# EAGLE schematic RoverBaseboard (EAGLE 6.4)
DATABASE: /home/mes/eagle/PARTSDB.txt
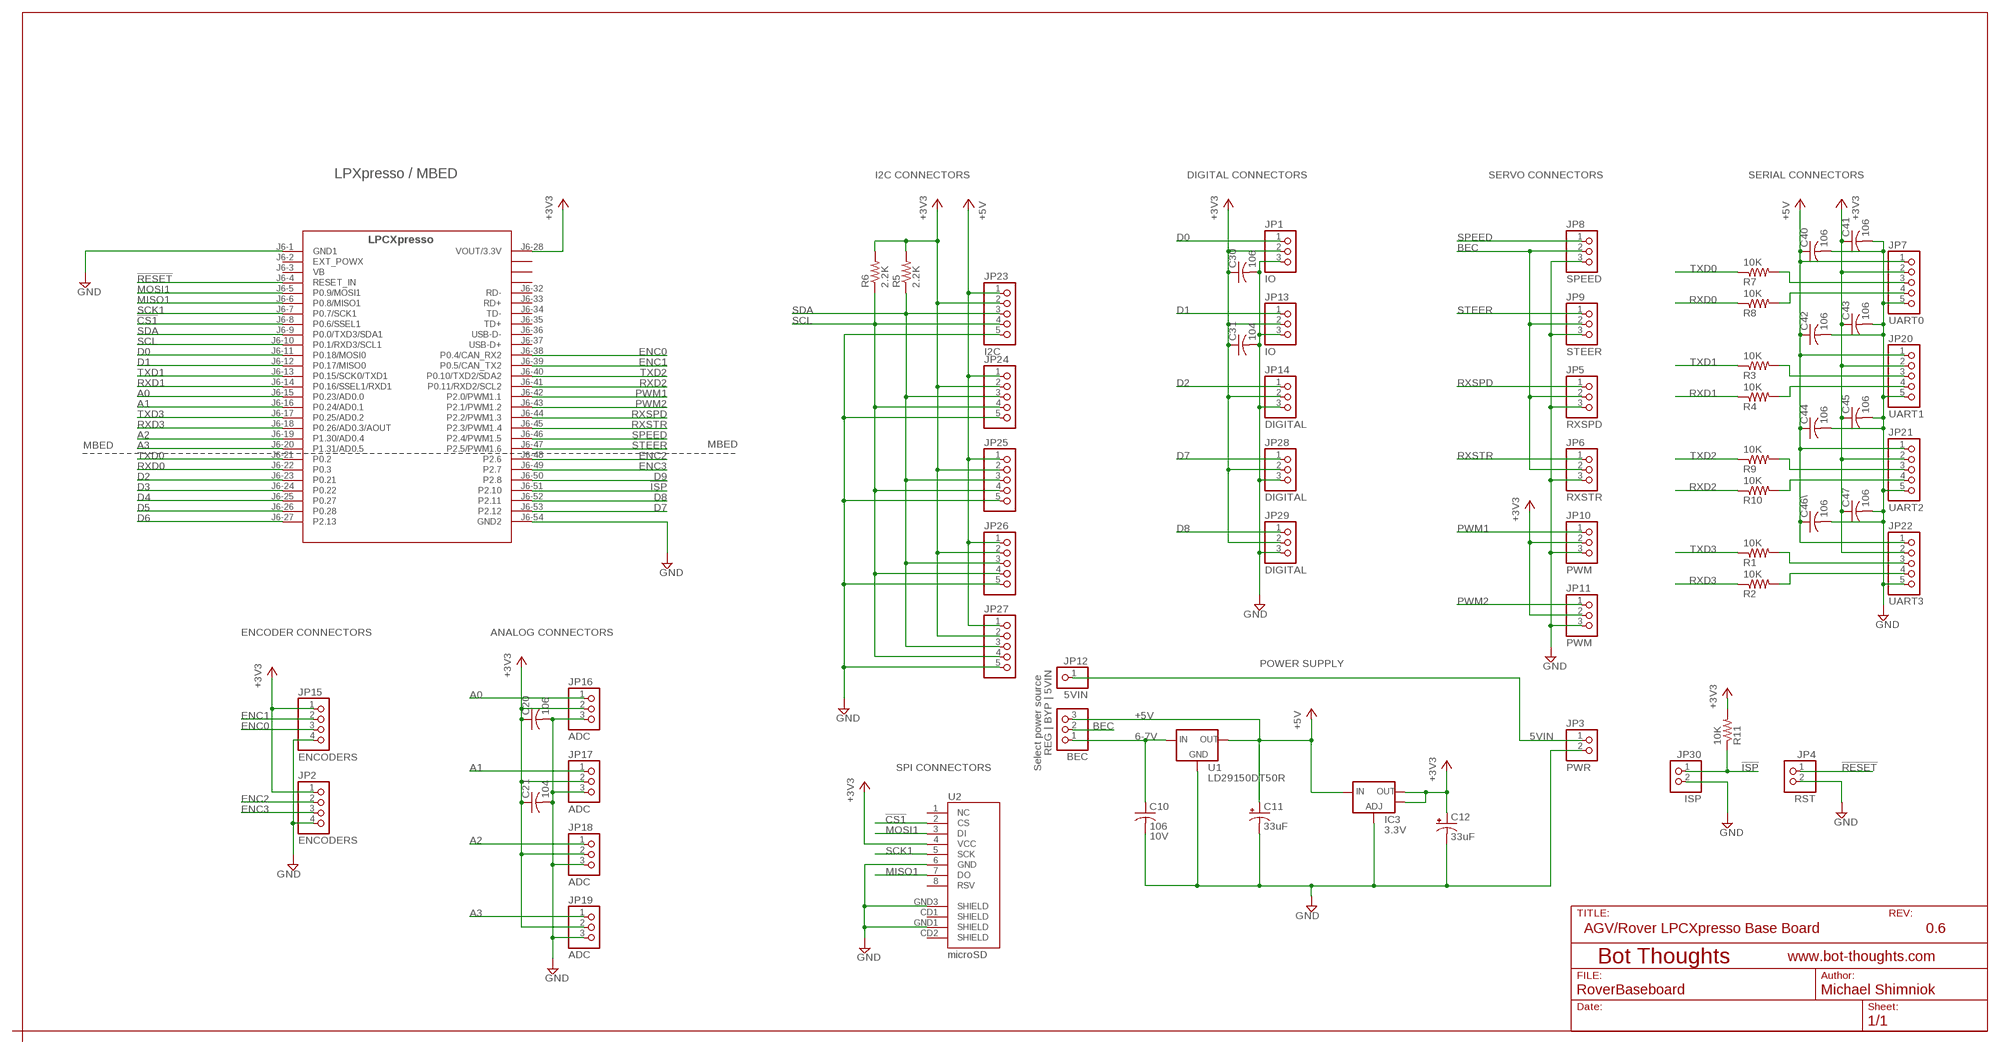
[diagram p0: schematic, sheet 1]

## Parts
BEC  REG | BYP | 5VIN  PINHD-1X03_2.54-S  [1X03-S]
C10  106  C-USC1206  [C1206]
C11  33uF  CPOL-USSMCB  [SMC_B]
C12  33uF  CPOL-USSMCB  [SMC_B]
C20  106  C-USC0603  [C0603]
C21  104  C-USC0603  [C0603]
C30  106  C-USC0603  [C0603]
C31  104  C-USC0603  [C0603]
C40  106  C-USC0603  [C0603]
C41  106  C-USC0603  [C0603]
C42  106  C-USC0603  [C0603]
C43  106  C-USC0603  [C0603]
C44  106  C-USC0603  [C0603]
C45  106  C-USC0603  [C0603]
C46\  106  C-USC0603  [C0603]
C47  106  C-USC0603  [C0603]
IC3  3.3V  V_REG_LM1117SOT223  [SOT223]
JP1  IO  PINHD-1X03_2.54-S  [1X03-S]
JP2  ENCODERS  PINHD-1X04_2.54-S  [1X04-S]
JP3  PWR  PINHD-1X02_2.54-S  [1X02-S]
JP4  RST  PINHD-1X02_2.54-S  [1X02-S]
JP5  RXSPD  PINHD-1X03_2.54-S  [1X03-S]
JP6  RXSTR  PINHD-1X03_2.54-S  [1X03-S]
JP7  UART0  PINHD-1X05_2.54-S  [1X05-S]
JP8  SPEED  PINHD-1X03_2.54-S  [1X03-S]
JP9  STEER  PINHD-1X03_2.54-S  [1X03-S]
JP10  PWM  PINHD-1X03_2.54-S  [1X03-S]
JP11  PWM  PINHD-1X03_2.54-S  [1X03-S]
JP12  5VIN  PINHD-1X01_2.54-S  [1X01-S]
JP13  IO  PINHD-1X03_2.54-S  [1X03-S]
JP14  DIGITAL  PINHD-1X03_2.54-S  [1X03-S]
JP15  ENCODERS  PINHD-1X04_2.54-S  [1X04-S]
JP16  ADC  PINHD-1X03_2.54-S  [1X03-S]
JP17  ADC  PINHD-1X03_2.54-S  [1X03-S]
JP18  ADC  PINHD-1X03_2.54-S  [1X03-S]
JP19  ADC  PINHD-1X03_2.54-S  [1X03-S]
JP20  UART1  PINHD-1X05_2.54-S  [1X05-S]
JP21  UART2  PINHD-1X05_2.54-S  [1X05-S]
JP22  UART3  PINHD-1X05_2.54-S  [1X05-S]
JP23  I2C  PINHD-1X05_2.54-S  [1X05-S]
JP24  PINHD-1X05_2.54-S  [1X05-S]
JP25  PINHD-1X05_2.54-S  [1X05-S]
JP26  PINHD-1X05_2.54-S  [1X05-S]
JP27  PINHD-1X05_2.54-S  [1X05-S]
JP28  DIGITAL  PINHD-1X03_2.54-S  [1X03-S]
JP29  DIGITAL  PINHD-1X03_2.54-S  [1X03-S]
JP30  ISP  PINHD-1X02_2.54-S  [1X02-S]
R1  10K  R-US_R0603  [R0603]
R2  10K  R-US_R0603  [R0603]
R3  10K  R-US_R0603  [R0603]
R4  10K  R-US_R0603  [R0603]
R5  2.2K  R-US_R0603  [R0603]
R6  2.2K  R-US_R0603  [R0603]
R7  10K  R-US_R0603  [R0603]
R8  10K  R-US_R0603  [R0603]
R9  10K  R-US_R0603  [R0603]
R10  10K  R-US_R0603  [R0603]
R11  10K  R-US_R0603  [R0603]
U1  LD29150DT50R  LD29150DT  [DPAK]
U2  microSD  USD-SOCKETNEW  [MICRO-SD-SOCKET-PP]
U$1  LPCXPRESSO  LPCXPRESSO_NO_PAD_1768_REVB  [LPCXPRESSO_NO_PAD]

## Nets
5VIN: JP3.1 JP12.1
6-7V: BEC.1 C10.1 U1.1(VIN)
!CS1: U2.2(CS) U$1.J6-8(P0.6/SSEL1)
!ISP: JP30.1 R11.1 U$1.J6-51(P2.10)
!RESET: JP4.1 U$1.J6-4(RESET_IN)
+3V3: C12.+ C20.1 C21.1 C30.1 C31.1 C41.1 C43.1 C45.1 C47.1 IC3.2(OUT) IC3.4(OUT) JP1.2 JP2.1 JP7.2 JP10.2 JP11.2 JP13.2 JP14.2 JP15.1 JP16.2 JP17.2 JP18.2 JP19.2 JP20.2 JP21.2 JP22.2 JP23.2 JP24.2 JP25.2 JP26.2 JP27.2 JP28.2 JP29.2 R5.2 R6.2 R11.2 U2.4(VCC) U$1.J6-28(VOUT/3.3V)
+5V: BEC.3 C11.+ C40.1 C42.1 C44.1 C46\.1 IC3.3(IN) JP7.1 JP20.1 JP21.1 JP22.1 JP23.1 JP24.1 JP25.1 JP26.1 JP27.1 U1.3(VOUT)
A0: JP16.1 U$1.J6-15(P0.23/AD0.0)
A1: JP17.1 U$1.J6-16(P0.24/AD0.1)
A2: JP18.1 U$1.J6-19(P1.30/AD0.4)
A3: JP19.1 U$1.J6-20(P1.31/AD0.5)
BEC: BEC.2 JP5.2 JP6.2 JP8.2 JP9.2
D0: JP1.1 U$1.J6-11(P0.18/MOSI0)
D1: JP13.1 U$1.J6-12(P0.17/MISO0)
D2: JP14.1 U$1.J6-23(P0.21)
D3: U$1.J6-24(P0.22)
D4: U$1.J6-25(P0.27)
D5: U$1.J6-26(P0.28)
D6: U$1.J6-27(P2.13)
D7: JP28.1 U$1.J6-53(P2.12)
D8: JP29.1 U$1.J6-52(P2.11)
D9: U$1.J6-50(P2.8)
ENC0: JP15.3 U$1.J6-38(P0.4/CAN_RX2)
ENC1: JP15.2 U$1.J6-39(P0.5/CAN_TX2)
ENC2: JP2.2 U$1.J6-48(P2.6)
ENC3: JP2.3 U$1.J6-49(P2.7)
GND: C10.2 C11.- C12.- C20.2 C21.2 C30.2 C31.2 C40.2 C41.2 C42.2 C43.2 C44.2 C45.2 C46\.2 C47.2 IC3.1(ADJ) JP1.3 JP2.4 JP3.2 JP4.2 JP5.3 JP6.3 JP7.5 JP8.3 JP9.3 JP10.3 JP11.3 JP13.3 JP14.3 JP15.4 JP16.3 JP17.3 JP18.3 JP19.3 JP20.5 JP21.5 JP22.5 JP23.5 JP24.5 JP25.5 JP26.5 JP27.5 JP28.3 JP29.3 JP30.2 U1.4(GND) U2.6(GND) U2.GND1(SHIELD) U2.GND3(SHIELD) U$1.J6-1(GND1) U$1.J6-54(GND2)
MISO1: U2.7(DO) U$1.J6-6(P0.8/MISO1)
MOSI1: U2.3(DI) U$1.J6-5(P0.9/MOSI1)
N$1: JP22.3 R1.2
N$2: JP22.4 R2.2
N$6: JP7.3 R7.2
N$7: JP7.4 R8.2
N$9: JP20.3 R3.2
N$10: JP20.4 R4.2
N$16: JP21.3 R9.2
N$17: JP21.4 R10.2
PWM1: JP10.1 U$1.J6-42(P2.0/PWM1.1)
PWM2: JP11.1 U$1.J6-43(P2.1/PWM1.2)
RXD0: R8.1 U$1.J6-22(P0.3)
RXD1: R4.1 U$1.J6-14(P0.16/SSEL1/RXD1)
RXD2: R10.1 U$1.J6-41(P0.11/RXD2/SCL2)
RXD3: R2.1 U$1.J6-18(P0.26/AD0.3/AOUT)
RXSPD: JP5.1 U$1.J6-44(P2.2/PWM1.3)
RXSTR: JP6.1 U$1.J6-45(P2.3/PWM1.4)
SCK1: U2.5(SCK) U$1.J6-7(P0.7/SCK1)
SCL: JP23.4 JP24.4 JP25.4 JP26.4 JP27.4 R6.1 U$1.J6-10(P0.1/RXD3/SCL1)
SDA: JP23.3 JP24.3 JP25.3 JP26.3 JP27.3 R5.1 U$1.J6-9(P0.0/TXD3/SDA1)
SPEED: JP8.1 U$1.J6-46(P2.4/PWM1.5)
STEER: JP9.1 U$1.J6-47(P2.5/PWM1.6)
TXD0: R7.1 U$1.J6-21(P0.2)
TXD1: R3.1 U$1.J6-13(P0.15/SCK0/TXD1)
TXD2: R9.1 U$1.J6-40(P0.10/TXD2/SDA2)
TXD3: R1.1 U$1.J6-17(P0.25/AD0.2)
Unconnected: U2.1(NC) U2.8(RSV) U2.CD1(SHIELD) U2.CD2(SHIELD) U$1.J6-2(EXT_POWX) U$1.J6-3(VB) U$1.J6-29 U$1.J6-30 U$1.J6-31 U$1.J6-32(RD-) U$1.J6-33(RD+) U$1.J6-34(TD-) U$1.J6-35(TD+) U$1.J6-36(USB-D-) U$1.J6-37(USB-D+)

## Notes on the sheet
- LPXpresso / MBED | I2C CONNECTORS | DIGITAL CONNECTORS | SERVO CONNECTORS | SERIAL CONNECTORS
- MBED | MBED
- ENCODER CONNECTORS | ANALOG CONNECTORS
- POWER SUPPLY
- SPI CONNECTORS | Select power source
- AGV/Rover LPCXpresso Base Board | 0.6

## Library data of the parts
BEC = pinhead-2:PINHD-1X03: PIN HEADER
C10 = rcl:C-US: CAPACITOR, American symbol; VOLTAGE: 10V
C11 C12 = rcl:CPOL-US: POLARIZED CAPACITOR, American symbol
C20 C21 C30 C31 C40-C45 C46\ C47 = rcl:C-US: CAPACITOR, American symbol
IC3 = SparkFun:V_REG_LM1117: Voltage Regulator LM1117 Standard adjustable voltage regulator but in SMD form. Spark Fun Electronics SKU : COM-00595
JP1 JP5 JP6 JP8-JP11 JP13 JP14 JP16-JP19 JP28 JP29 = pinhead-2:PINHD-1X03: PIN HEADER; OC_NEWARK: unknown
JP2 JP15 = pinhead-2:PINHD-1X04: PIN HEADER; OC_NEWARK: unknown
JP3 JP4 JP30 = pinhead-2:PINHD-1X02: PIN HEADER; OC_NEWARK: unknown
JP7 JP20-JP27 = pinhead-2:PINHD-1X05: PIN HEADER
JP12 = pinhead-2:PINHD-1X01: PIN HEADER
R1-R4 R7-R11 = rcl:R-US_: RESISTOR, American symbol; MPN: WCR0805-220RFI; OC_NEWARK: 98K2621
R5 R6 = rcl:R-US_: RESISTOR, American symbol; OC_NEWARK: unknown
U1 = bt_regulator:LD29150: STM LD29150 LDO Voltage Regulator The LD29150xx is a high current, high accuracy, low-dropout voltage regulator series. These regulators feature 400 mV dropout voltage and very low ground current. Designed for high current loads, these devices are also used in lower current, extremely low dropout-critical systems, where their tiny dropout voltage and ground current values are important attributes. Datasheet.pdf <http://www.st.com/web/en/resource/technical/document/datasheet/CD00003403.pdf>
U2 = SparkFun:USD-SOCKET: microSD Socket Push-push type uSD socket. Schematic element and footprint production proven. Spark Fun Electronics SKU : PRT-00127. tDoc lines correctly indicate media card edge positions when inserting (unlocked, locked, depressed).
U$1 = LPCXpresso:LPCXPRESSO_NO_PAD: NXP LPCXpresso by Embedded Artists LPCXpresso is a new, low-cost development platform available from NXP. It supports NXP's ARM-based LPC microcontrollers. The platform is comprised of a simplified Eclipse-based IDE and low-cost target boards which include an attached JTAG debugger. http://ics.nxp.com/lpcxpresso/ NOTE: This version does NOT include the 37-pin pads on the top of the board